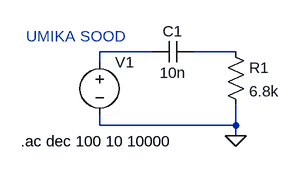
[diagram p0: schematic HighPassFilter.asc]
HighPassFilter.asc, the LTspice schematic file:
Version 4
SHEET 1 880 680
WIRE 176 288 96 288
WIRE 304 288 240 288
WIRE 96 304 96 288
WIRE 96 400 96 384
WIRE 304 400 304 368
WIRE 304 400 96 400
WIRE 304 416 304 400
FLAG 304 416 0
SYMBOL voltage 96 288 R0
SYMATTR InstName V1
SYMATTR Value ""
SYMATTR Value2 AC 1
SYMBOL cap 240 272 R90
WINDOW 0 0 32 VBottom 2
WINDOW 3 32 32 VTop 2
SYMATTR InstName C1
SYMATTR Value 10n
SYMBOL res 288 272 R0
SYMATTR InstName R1
SYMATTR Value 6.8k
TEXT -24 424 Left 2 !.ac dec 100 10 10000
TEXT -16 264 Left 2 ;UMIKA SOOD

The netlist it stands for:
* HighPassFilter.asc
V1 N001 0 AC 1
C1 N002 N001 10n
R1 N002 0 6.8k
.ac dec 100 10 10000
* UMIKA SOOD
.backanno
.end